# Altium project SDR_PMR.PrjPcb (part 12 of 12)
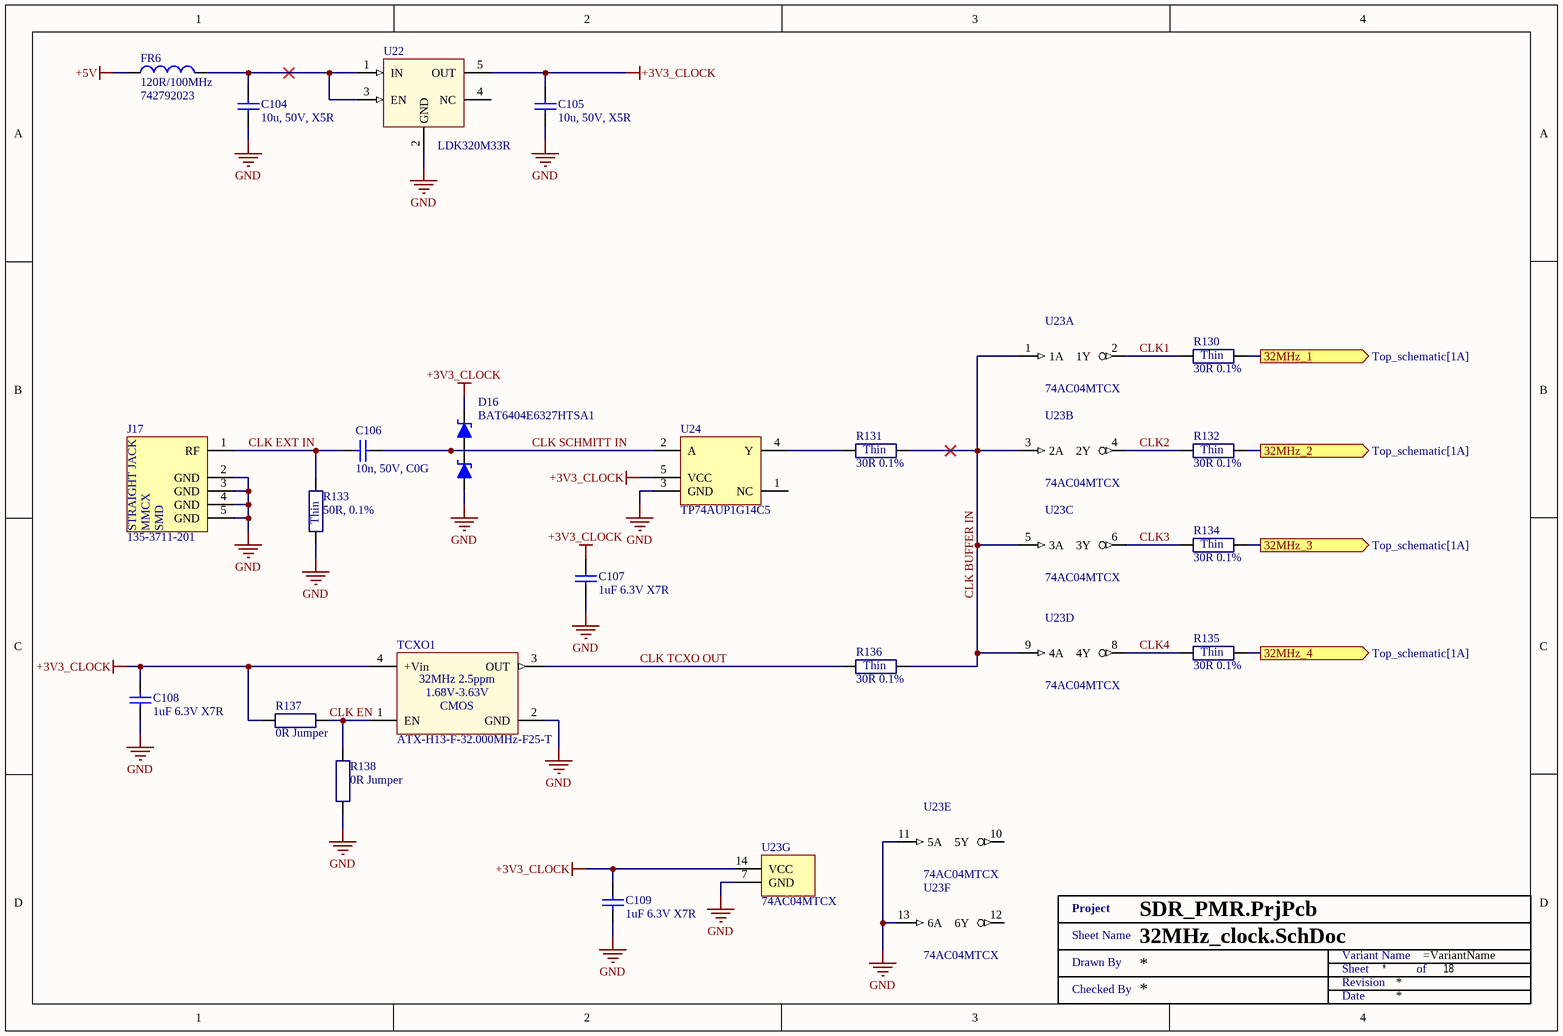
[diagram p20: 32MHz_clock.SchDoc]

## Nets that join several sheets
+3V3_CODEC: Microphone_Amplifier (D1.2 D2.2), Audio_codec (10 pins), Power_3V3 (C93.2 U17.5)
+3V3_MCU: M12_Connector (D12.5), MCU (26 pins), PTT (D5.5 Q5.1 R108.2), Power_3V3 (6 pins)
+3V3_RF: Radio (16 pins), LNA (7 pins), RF_FILTER (C56.2 U7.8 U7.9), Power_3V3 (C95.2 U18.5)
+5V: Power (14 pins), M12_Connector (C88.2 F8.1), Audio_codec (J15.7), Power_Amplifier (10 pins), MCU (J5.8), PTT (D6.2), Power_3V3 (D15.1 FR3.1 FR4.1 FR5.1), CB_CONNECTOR (C103.2 J16.8), 32MHz_clock (FR6.1)
+30V: Power (C25.1 C27.2 D4.2 R29.2), Microphone_Amplifier (C8.2 U1.8), Headphone_Amplifier (9 pins)
+POWER_RAIL: Power (C21.2 FR1.1 U2.1), M12_Connector (C87.1 FR2.1), CB_CONNECTOR (C101.1 C102.2 J16.14 J16.16)
GND: Power (33 pins), M12_Connector (12 pins), Microphone_Amplifier (8 pins), Headphone_Amplifier (11 pins), Audio_codec (16 pins), Radio (44 pins), Power_Amplifier (25 pins), 70cm_BPF (8 pins), 442MHz-450MHz_BPF (8 pins), LNA (24 pins), RF_FILTER (19 pins), MCU (27 pins), PTT (C86.1 D5.2 Q6.2 SW2.1), USB_connector (13 pins), Power_3V3 (16 pins), CB_CONNECTOR (7 pins), 32MHz_clock (18 pins)
HALF BIAS MIC: Microphone_Amplifier (R6.1 R7.1 R11.2 R17.1), Headphone_Amplifier (U14.6 U14.7)
CB_CLK: MCU (R104.1), CB_CONNECTOR (J16.3)
CB_DIN: MCU (U15.55), CB_CONNECTOR (J16.5)
CB_DOUT: MCU (R91.1), CB_CONNECTOR (J16.7)
CB_nIRQ: MCU (R102.2 U15.64), CB_CONNECTOR (J16.13)
CB_nRESET: MCU (R103.2 U15.65), CB_CONNECTOR (J16.15)
CB_WS: MCU (R90.1), CB_CONNECTOR (J16.9)
I2C_SCL: Audio_codec (J15.1), MCU (J5.6 R105.2 U15.61), CB_CONNECTOR (J16.4)
I2C_SDA: Audio_codec (J15.3), MCU (J5.7 R107.2 U15.62), CB_CONNECTOR (J16.6)
I2S0_SCLK: Audio_codec (U11.2), MCU (R94.1)
I2S0_SDI: Audio_codec (R57.1), MCU (R98.1)
I2S0_SDO: Audio_codec (U11.5), MCU (U15.39)
I2S0_WS: Audio_codec (U11.3), MCU (R95.1)
LNA ON: LNA (Q9.1 Q10.1 R123.2 R127.1), MCU (U15.41)
MCU 30V CTRL: Power (R30.1), MCU (U15.40)
NetC4_1: M12_Connector (D9.2 F3.1), Microphone_Amplifier (C4.1 R10.1 R13.1)
NetC4_2: M12_Connector (D8.2 F2.1), Microphone_Amplifier (C4.2 R1.1 R10.2)
NetC33_2: Radio (U10.11), Power_Amplifier (C33.2)
NetC40_2: Radio (C40.2), Power_Amplifier (R34.1 R35.2)
NetC63_2: M12_Connector (D11.2 F4.1), Headphone_Amplifier (C63.2)
NetD1_3: Microphone_Amplifier (D1.3 R4.2), Audio_codec (U11.15)
NetD2_3: Microphone_Amplifier (D2.3 R16.2), Audio_codec (U11.16)
NetJ10_1: Radio (U8.11), 70cm_BPF (J10.1)
NetJ11_1: Radio (U9.5), 70cm_BPF (J11.1)
NetJ12_1: Radio (U8.5), 442MHz-450MHz_BPF (J12.1)
NetJ13_1: Radio (U9.11), 442MHz-450MHz_BPF (J13.1)
NetJ16_10: CB_CONNECTOR (J16.10), 32MHz_clock (R130.2)
NetQ4_1: Radio (Q4.1 R46.1), MCU (U15.27)
NetQ5_2: MCU (U15.19), PTT (Q5.2 R108.1)
NetQ6_1: MCU (U15.20), PTT (Q6.1)
NetR50_1: Radio (R50.1), 32MHz_clock (R135.2)
NetR52_1: Radio (R52.1), MCU (U15.14)
NetR54_1: RF_FILTER (R54.1), MCU (U15.28)
NetR71_1: Headphone_Amplifier (R71.1 R82.1), Audio_codec (U11.19)
NetR77_1: Headphone_Amplifier (R77.1 R79.1), Audio_codec (U11.20)
NetR109_1: M12_Connector (R112.1), PTT (R109.1 R110.2 SW2.3)
NetR132_2: MCU (U15.10), 32MHz_clock (R132.2)
NetR134_2: MCU (U15.42), 32MHz_clock (R134.2)
NetU7_5: Radio (U10.2), RF_FILTER (U7.5)
NetU9_2: Radio (U9.2), LNA (U21.2)
NetU10_5: Radio (U10.5), LNA (U19.2)
PG_5V: Power (Q1.1 R24.1 U2.2 U3.4), Power_3V3 (U16.13 U17.3 U18.3)
RADIO RESET: Radio (U6.9), MCU (U15.13)
RADIO_CLK: Radio (R42.1), MCU (U15.24)
RADIO_DIN: Radio (R43.1), MCU (R89.1)
RADIO_DOUT: Radio (U6.13), MCU (U15.26)
RADIO_SPI_MISO: Radio (R44.1), MCU (U15.59)
RADIO_SPI_MOSI: Radio (U6.19), MCU (R93.1)
RADIO_SPI_nCS: Radio (U6.20), MCU (R92.1)
RADIO_SPI_SCLK: Radio (U6.17), MCU (R106.1)
RADIO_WS: Radio (R47.1), MCU (U15.23)
UART_CTRL_RX: M12_Connector (D12.3), MCU (U15.18)
UART_CTRL_TX: M12_Connector (D12.1), MCU (R88.1)
USB_D_N: MCU (U15.46), USB_connector (D13.4)
USB_D_P: MCU (U15.47), USB_connector (D13.6)
USB_VUSB: MCU (U15.44), USB_connector (R113.1 R115.2)

## Assembly variants
Osazeni: not fitted C105 C106 C? D? J? L5 R54 R56 R58 R60 R62 R64 R131 R132 R134 R? R? R? TCXO1 U24